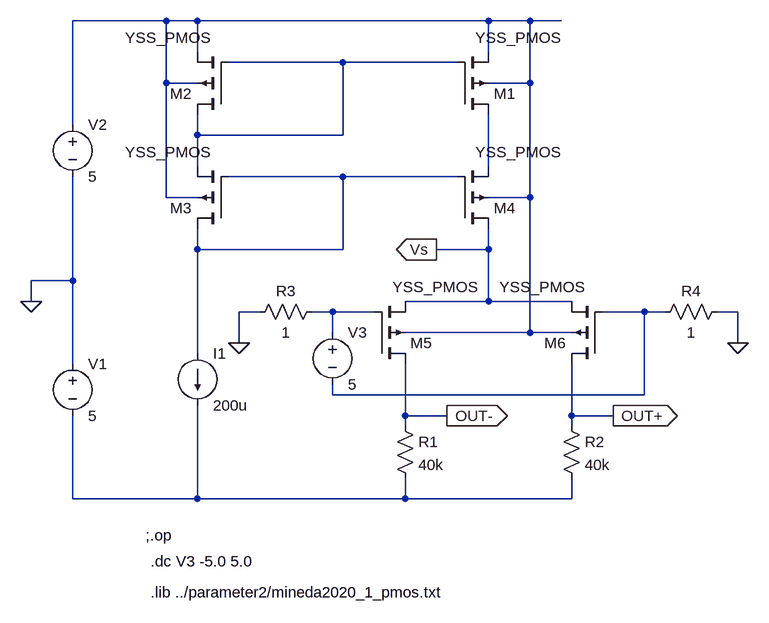
[diagram p0: schematic diffamp_test10umrealCS.asc]
diffamp_test10umrealCS.asc, the LTspice schematic file:
Version 4
SHEET 1 1536 2968
WIRE -464 -192 -608 -192
WIRE -416 -192 -464 -192
WIRE 32 -192 -416 -192
WIRE 96 -192 32 -192
WIRE 144 -192 96 -192
WIRE -416 -144 -416 -192
WIRE 32 -144 32 -192
WIRE -192 -128 -368 -128
WIRE -16 -128 -192 -128
WIRE -464 -96 -464 -192
WIRE -416 -96 -464 -96
WIRE 96 -96 96 -192
WIRE 96 -96 32 -96
WIRE -608 -32 -608 -192
WIRE -416 -16 -416 -48
WIRE -192 -16 -192 -128
WIRE -192 -16 -416 -16
WIRE -416 32 -416 -16
WIRE 32 32 32 -48
WIRE -192 48 -368 48
WIRE -16 48 -192 48
WIRE -464 80 -464 -96
WIRE -416 80 -464 80
WIRE 96 80 96 -96
WIRE 96 80 32 80
WIRE -416 160 -416 128
WIRE -192 160 -192 48
WIRE -192 160 -416 160
WIRE 32 160 32 128
WIRE 32 160 -48 160
WIRE -608 208 -608 48
WIRE -608 208 -672 208
WIRE -672 240 -672 208
WIRE 32 240 32 160
WIRE 32 240 -96 240
WIRE 160 240 32 240
WIRE -320 256 -352 256
WIRE -208 256 -240 256
WIRE -144 256 -208 256
WIRE 272 256 208 256
WIRE 304 256 272 256
WIRE 416 256 384 256
WIRE -208 288 -208 256
WIRE 96 288 96 80
WIRE 96 288 -96 288
WIRE 160 288 96 288
WIRE -352 304 -352 256
WIRE 416 304 416 256
WIRE -416 320 -416 160
WIRE -608 336 -608 208
WIRE -208 384 -208 368
WIRE 272 384 272 256
WIRE 272 384 -208 384
WIRE -96 416 -96 336
WIRE -32 416 -96 416
WIRE 160 416 160 336
WIRE 224 416 160 416
WIRE -96 432 -96 416
WIRE 160 432 160 416
WIRE -608 544 -608 416
WIRE -416 544 -416 400
WIRE -416 544 -608 544
WIRE -96 544 -96 512
WIRE -96 544 -416 544
WIRE 160 544 160 512
WIRE 160 544 -96 544
FLAG -672 240 0
FLAG -48 160 Vs
IOPIN -48 160 Out
FLAG 416 304 0
FLAG -352 304 0
FLAG 224 416 OUT+
IOPIN 224 416 Out
FLAG -32 416 OUT-
IOPIN -32 416 Out
SYMBOL voltage -608 320 R0
WINDOW 123 0 0 Left 2
WINDOW 39 0 0 Left 2
SYMATTR InstName V1
SYMATTR Value 5
SYMBOL pmos4 -16 -48 M180
WINDOW 3 28 118 Left 2
SYMATTR Value YSS_PMOS
SYMATTR InstName M1
SYMATTR Value2 l=14u w=14u m=20
SYMBOL voltage -608 -48 R0
WINDOW 123 0 0 Left 2
WINDOW 39 0 0 Left 2
SYMATTR InstName V2
SYMATTR Value 5
SYMBOL current -416 320 R0
WINDOW 123 0 0 Left 2
WINDOW 39 0 0 Left 2
SYMATTR InstName I1
SYMATTR Value 200u
SYMBOL pmos4 -368 -48 R180
WINDOW 3 28 118 Left 2
SYMATTR Value YSS_PMOS
SYMATTR InstName M2
SYMATTR Value2 l=14u w=14u m=20
SYMBOL voltage -208 272 R0
WINDOW 123 0 0 Left 2
WINDOW 39 0 0 Left 2
SYMATTR InstName V3
SYMATTR Value 5
SYMBOL pmos4 -368 128 R180
WINDOW 3 28 118 Left 2
SYMATTR Value YSS_PMOS
SYMATTR InstName M3
SYMATTR Value2 l=14u w=14u m=20
SYMBOL pmos4 -16 128 M180
WINDOW 3 28 118 Left 2
SYMATTR Value YSS_PMOS
SYMATTR InstName M4
SYMATTR Value2 l=14u w=14u m=20
SYMBOL pmos4 -144 336 M180
WINDOW 3 28 118 Left 2
SYMATTR Value YSS_PMOS
SYMATTR InstName M5
SYMATTR Value2 l=10u w=10u m=10
SYMBOL pmos4 208 336 R180
WINDOW 3 28 118 Left 2
SYMATTR Value YSS_PMOS
SYMATTR InstName M6
SYMATTR Value2 l=10u w=10u m=10
SYMBOL res -112 416 R0
SYMATTR InstName R1
SYMATTR Value 40k
SYMBOL res 144 416 R0
SYMATTR InstName R2
SYMATTR Value 40k
SYMBOL res -224 240 R90
WINDOW 0 0 56 VBottom 2
WINDOW 3 32 56 VTop 2
SYMATTR InstName R3
SYMATTR Value 1
SYMBOL res 400 240 R90
WINDOW 0 0 56 VBottom 2
WINDOW 3 32 56 VTop 2
SYMATTR InstName R4
SYMATTR Value 1
TEXT -488 640 Left 2 !.dc V3 -5.0 5.0
TEXT -488 688 Left 2 !.lib ../parameter2/mineda2020_1_pmos.txt
TEXT -496 600 Left 2 !;.op

The netlist it stands for:
* diffamp_test10umrealCS.asc
V1 0 N007 5
M1 N003 N002 N001 N001 YSS_PMOS l=14u w=14u m=20
V2 N001 0 5
I1 N004 N007 200u
M2 N002 N002 N001 N001 YSS_PMOS l=14u w=14u m=20
V3 N005 N006 5
M3 N004 N004 N002 N001 YSS_PMOS l=14u w=14u m=20
M4 Vs N004 N003 N001 YSS_PMOS l=14u w=14u m=20
M5 OUT- N005 Vs N001 YSS_PMOS l=10u w=10u m=10
M6 OUT+ N006 Vs N001 YSS_PMOS l=10u w=10u m=10
R1 OUT- N007 40k
R2 OUT+ N007 40k
R3 N005 0 1
R4 0 N006 1
.model NMOS NMOS
.model PMOS PMOS
.lib standard.mos
.dc V3 -5.0 5.0
.lib ../parameter2/mineda2020_1_pmos.txt
;.op
.backanno
.end